# EAGLE design HOTAS_TOP_v4_v10 (EAGLE 9.7.0)
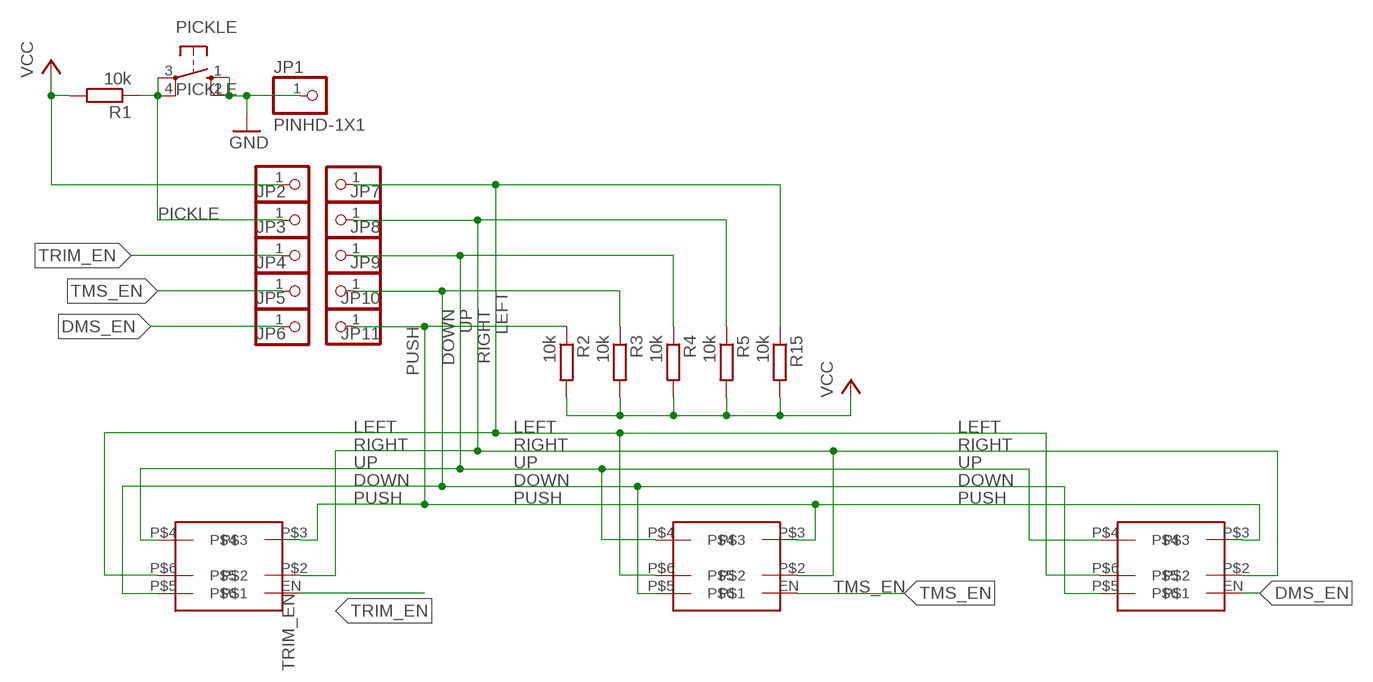
[diagram p0: schematic, sheet 1]

## Parts
JP1  PINHD-1X1  [1X01]
JP2  PINHD-1X1  [1X01]
JP3  PINHD-1X1  [1X01]
JP4  PINHD-1X1  [1X01]
JP5  PINHD-1X1  [1X01]
JP6  PINHD-1X1  [1X01]
JP7  PINHD-1X1  [1X01]
JP8  PINHD-1X1  [1X01]
JP9  PINHD-1X1  [1X01]
JP10  PINHD-1X1  [1X01]
JP11  PINHD-1X1  [1X01]
PICKLE  10-XX  [B3F-10XX]
R1  10k  R_CHIP-1206(3216-METRIC)  [RESC3216X70]
R2  10k  R_CHIP-1206(3216-METRIC)  [RESC3216X70]
R3  10k  R_CHIP-1206(3216-METRIC)  [RESC3216X70]
R4  10k  R_CHIP-1206(3216-METRIC)  [RESC3216X70]
R5  10k  R_CHIP-1206(3216-METRIC)  [RESC3216X70]
R15  10k  R_CHIP-1206(3216-METRIC)  [RESC3216X70]
U$1  FIVEWAYHATSSMD  [FIVEWAYHATSSMD]
U$2  FIVEWAYHATSSMD  [FIVEWAYHATSSMD]
U$3  FIVEWAYHATSSMD  [FIVEWAYHATSSMD]

## Nets
DMS_EN: JP6.1 U$3.EN
DOWN: JP10.1 R3.1 U$1.P$5 U$2.P$5 U$3.P$5
GND: JP1.1 PICKLE.1(S) PICKLE.2(S1)
LEFT: JP7.1 R15.1 U$1.P$6 U$2.P$6 U$3.P$6
PICKLE: JP3.1 PICKLE.3(P) PICKLE.4(P1) R1.1
PUSH: JP11.1 R2.1 U$1.P$3 U$2.P$3 U$3.P$3
RIGHT: JP8.1 R5.1 U$1.P$2 U$2.P$2 U$3.P$2
TMS_EN: JP5.1 U$2.EN
TRIM_EN: JP4.1 U$1.EN
UP: JP9.1 R4.1 U$1.P$4 U$2.P$4 U$3.P$4
VCC: JP2.1 R1.2 R2.2 R3.2 R4.2 R5.2 R15.2

## Library data of the parts
JP1-JP11 = Connector:PINHD-1X1: PIN HEADER; CATEGORY: Headers; DESCRIPTION: Header, Straight, 1 Position; MANUFACTURER: Generic; MPN: Generic; OPERATING_TEMPERATURE: Generic; PART_STATUS: Active; PITCH: 0.100" (2.54mm); ROHS_COMPLIANCE: Generic; SERIES: Generic; SUB-CATEGORY: Headers, Male Pins; TYPE: Board to Board or Cable, Unshrouded, Through Hole, Straight
PICKLE = switch-omron:10-XX: OMRON SWITCH; MPN: B3F-1000; OC_FARNELL: 176432; OC_NEWARK: 36M3542
R1-R5 R15 = Resistor:R: Resistor Fixed - Generic; CATEGORY: Resistor; SUB-CATEGORY: Fixed
U$1-U$3 = FiveWaySMD_V6:FIVEWAYHATSSMD

## Board
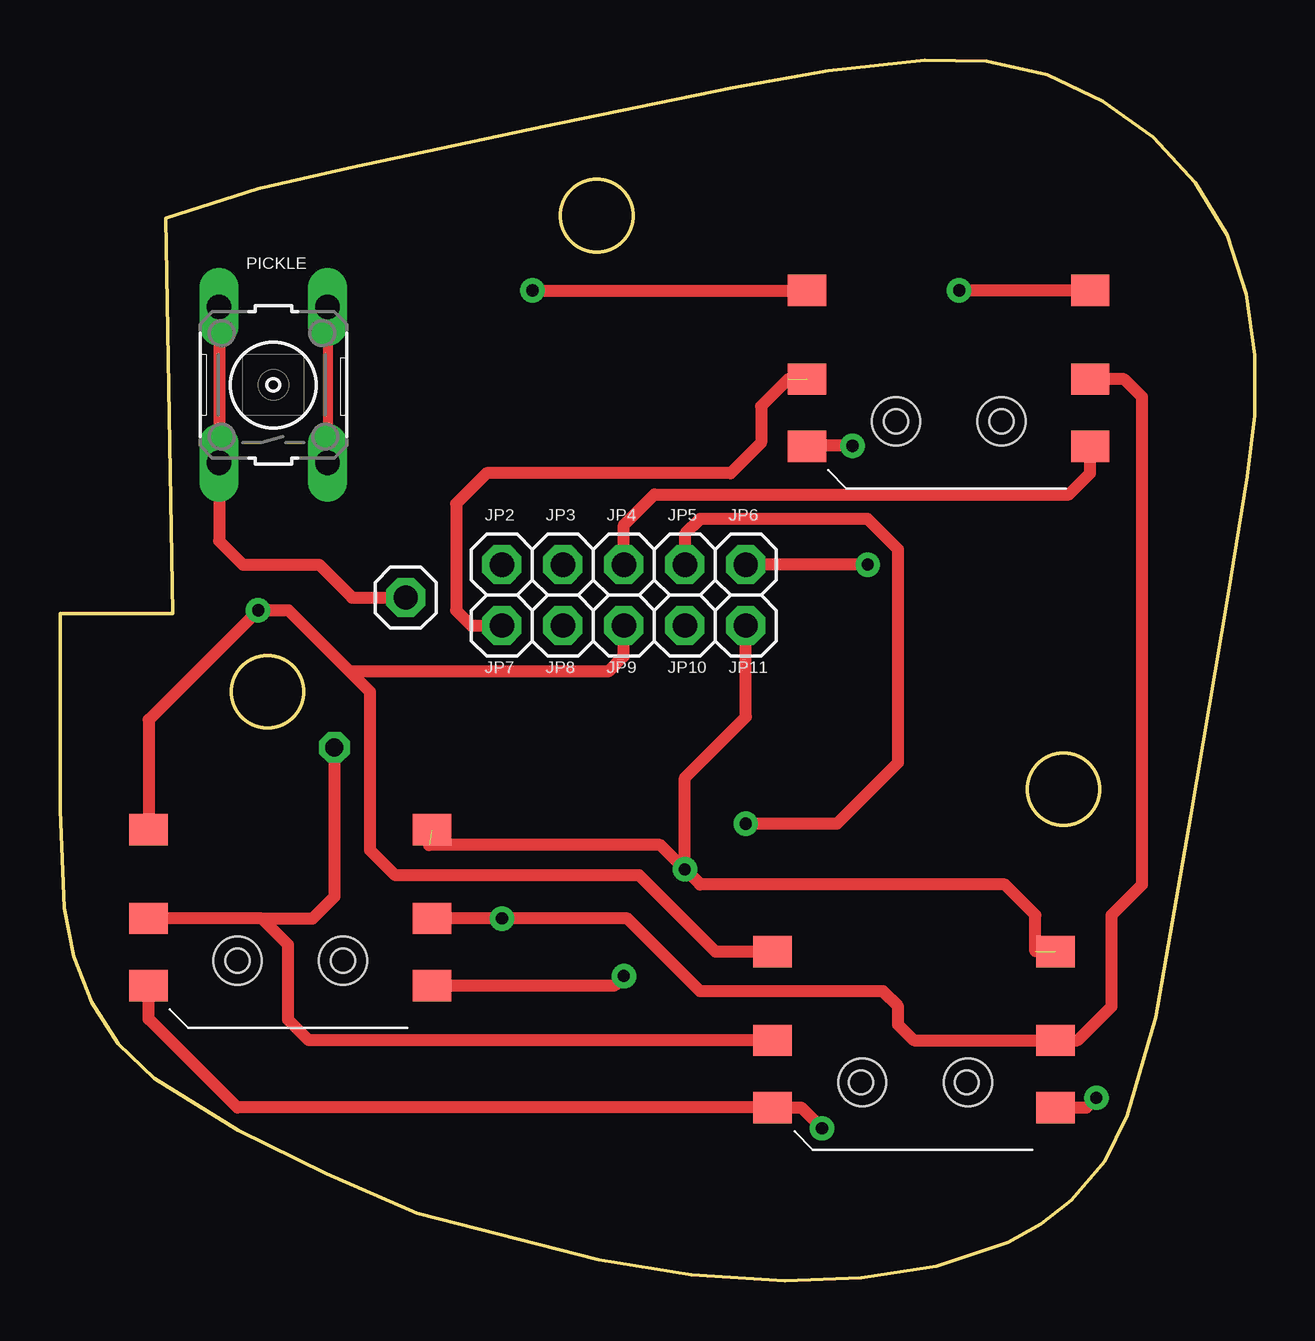
[diagram p1: board, top side]
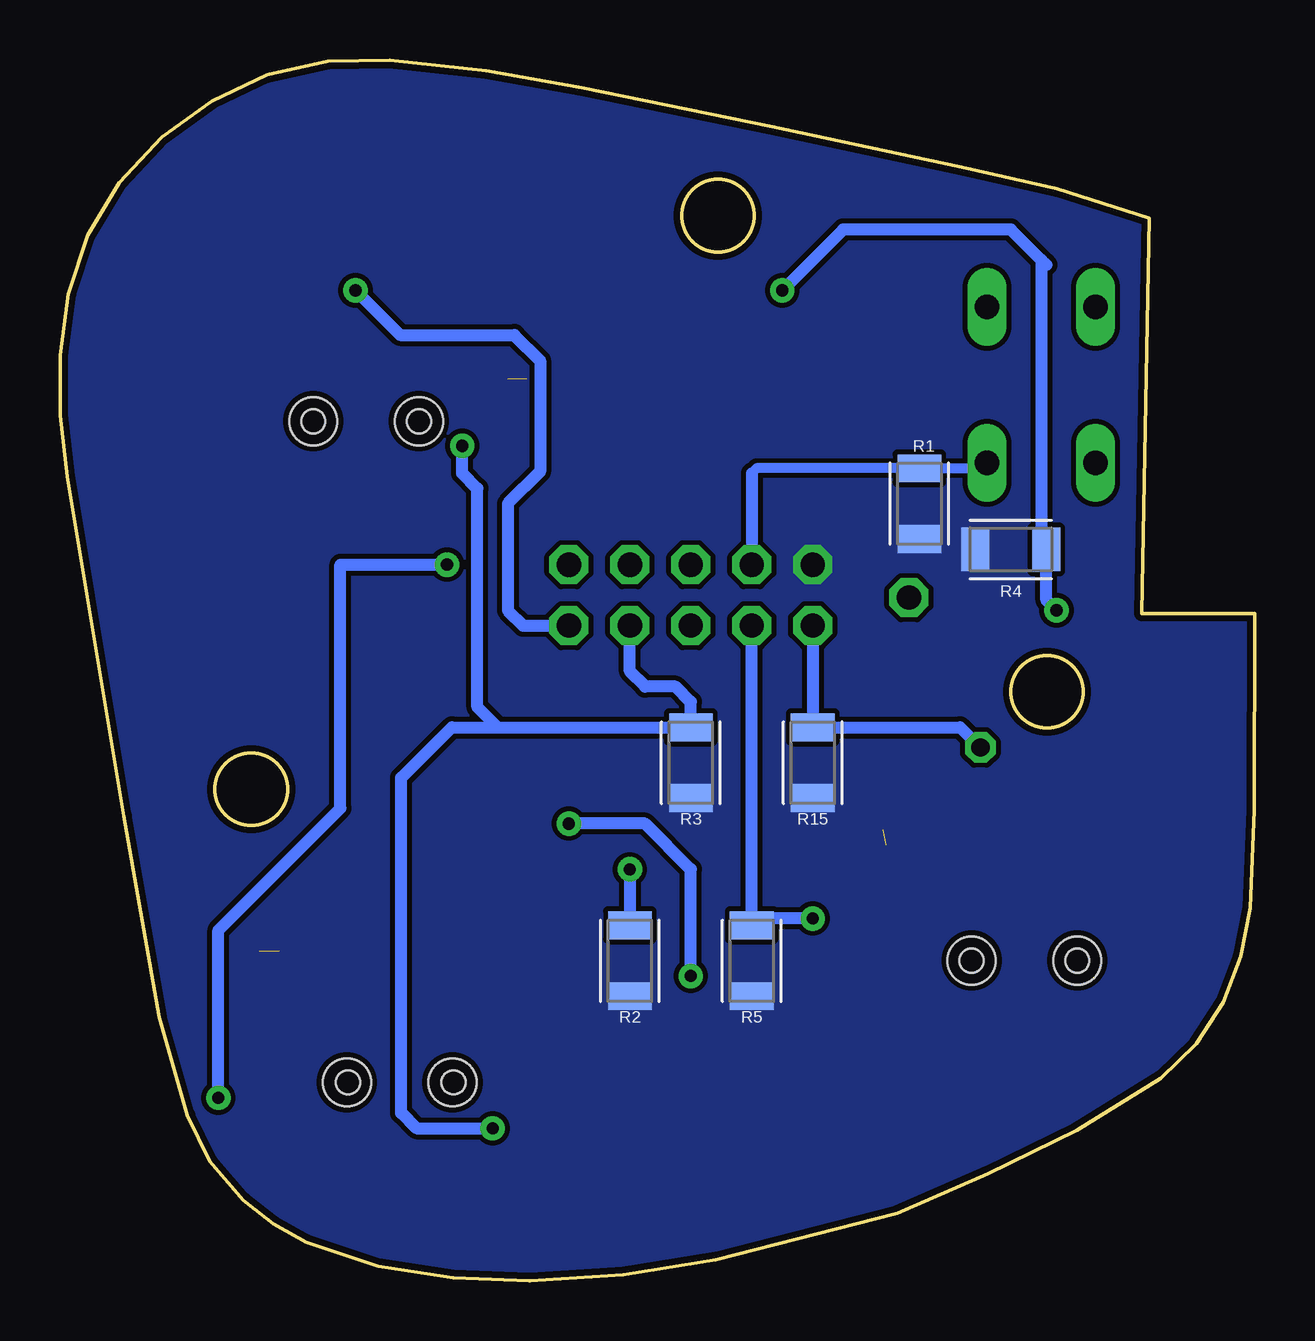
[diagram p2: board, bottom side, seen from below]

Size 49.78 x 50.88 mm. Coordinates in mm from the lower left corner, seen from the top.
Outline: 30.22,0 33.39,0.11 36.52,0.59 39.52,1.6 40.89,2.37 42.14,3.35 43.54,4.96 44.47,6.89 45.65,10.97 47.12,19.38 48.65,28.5 49.48,33.52 49.78,36.05 49.77,38.57 49.43,41.12 48.63,43.57 47.3,45.77 45.55,47.65 43.45,49.17 41.13,50.26 38.61,50.82 36.04,50.88 32.02,50.43 28.04,49.71 20.11,48.1 12.2,46.41 8.26,45.51 4.4,44.29 4.7,27.82 0,27.81 0.01,19.62 0.18,15.53 0.58,13.51 1.31,11.59 2.44,9.86 3.92,8.43 7.42,6.27 11.12,4.45 14.9,2.8 22.45,0.87 26.3,0.24 30.19,0 30.22,0
Outline: circle at 22.37,44.39 radius 1.5
Outline: circle at 41.81,20.48 radius 1.5
Outline: circle at 8.65,24.54 radius 1.5
Copper layers (1*16): Top 0.035mm / dielectric 1.5mm / Bottom 0.035mm
Design rules "SparkFun": minimum track width 8mil, minimum drill 20mil, track to track 8mil, track to pad 16mil, pad to pad 16mil, via to via 8mil, smd to smd 8mil, copper to edge 10mil, drill to drill 8mil, minimum pad ring 12mil, minimum via ring 10mil, stop-mask expansion 4mil, vias tented up to drill 25mil, thermal gap 10mil
Holes 2 mm at 34.83,35.82 39.23,35.82 7.39,13.34 11.79,13.34 33.43,8.26 37.83,8.26

### Footprints (pad centres in the part's own frame; a part is rotated, then mirrored left to right if it is on the bottom)
1X01 = drill 1.016 octagon: 1 0,0
B3F-10XX = drill 1.016 long: 1 -3.251,2.261; 2 3.251,2.261; 3 -3.251,-2.261; 4 3.251,-2.261
RESC3216X70 = smd 1.165 x 1.815: 1 -1.475,0; 2 1.475,0
FIVEWAYHATSSMD = smd 1.6 x 1.3: EN -11.05,6.5; P$2 -11.05,3.7; P$3 -11.05,0; P$4 0.75,0; P$5 0.75,6.5; P$6 0.75,3.7 | hole 1: -7.35,5.45; -2.95,5.45

### Placement (x,y rotation side)
JP1  14.41,28.47 0 top
JP2  18.41,29.84 0 top
JP3  20.95,29.84 0 top
JP4  23.5,29.84 0 top
JP5  26.04,29.84 0 top
JP6  28.57,29.84 0 top
JP7  18.41,27.3 0 top
JP8  20.95,27.3 0 top
JP9  23.5,27.3 0 top
JP10  26.04,27.3 0 top
JP11  28.57,27.3 0 top
PICKLE  8.89,37.34 90 top
R1  13.97,32.38 270 bottom
R2  26.04,13.33 270 bottom
R3  23.5,21.59 270 bottom
R4  10.16,30.48 180 bottom
R5  20.95,13.33 270 bottom
R15  18.41,21.59 270 bottom
U$1  31.88,41.27 180 top
U$2  4.45,18.79 180 top
U$3  30.43,13.71 180 top

### Tracks (layer width: path | path; a pad name or v marks a point on that pad's centre or on a via)
DMS_EN  (via drill 0.51)
  Top 0.508: v33.66,29.84 JP6.1 | U$3.EN 42.78,7.21 v43.18,7.62
  Bottom 0.508: v43.18,7.62 43.18,14.6 38.1,19.68 38.1,29.84 v33.66,29.84
DOWN  (via drill 0.51)
  Top 0.508: v33.02,34.8 31.15,34.8 U$1.P$5 | v31.75,6.35 30.88,7.21 U$3.P$5 7.39,7.21 3.69,10.91 U$2.P$5
  Bottom 0.508: 31.55,23.06 33.45,23.06 35.56,20.95 35.56,6.98 34.92,6.35 v31.75,6.35 | 31.55,23.06 R3.1 23.5,24.13 24.13,24.76 25.4,24.76 26.04,25.4 JP10.1 | 31.55,23.06 32.38,23.9 32.38,33.02 33.02,33.65 v33.02,34.8
GND
  Top 0.508: PICKLE.2 PICKLE.1 6.63,30.83 7.62,29.84 10.79,29.84 12.17,28.47 JP1.1
LEFT  (via drill 0.76)  (1 unrouted)
  Top 0.508: v11.43,22.22 11.43,16 10.52,15.09 8.41,15.09 | 30.34,37.57 29.21,36.45 29.21,34.92 27.94,33.65 17.78,33.65 16.51,32.38 16.51,27.94 17.14,27.3 JP7.1 | 8.41,15.09 9.5,14.01 9.5,10.88 10.37,10.01 U$3.P$6 | 8.41,15.09 U$2.P$6
  Bottom 0.508: v11.43,22.22 12.27,23.06 R15.1 JP7.1
PICKLE
  Top 0.406: PICKLE.4 PICKLE.3
  Bottom 0.406: PICKLE.3 11.38,33.86 R1.1 20.75,33.86 20.95,33.65
  Bottom 0.508: 20.95,33.65 JP3.1
PUSH  (via drill 0.51)  (2 unrouted)
  Top 0.508: v26.04,17.14 25.02,18.16 15.38,18.16 | 40.64,13.73 40.64,15.24 39.37,16.51 26.67,16.51 v26.04,17.14 | v26.04,17.14 26.04,20.95 28.57,23.49 JP11.1 | U$1.P$3 v37.47,41.27
  Bottom 0.508: v26.04,17.14 R2.1 | v37.47,41.27 35.61,39.42 30.84,39.42 29.78,38.35 29.78,33.72 31.11,32.38 31.11,27.94 30.48,27.3 JP11.1
RIGHT  (via drill 0.51)
  Top 0.508: U$1.P$2 44.34,37.57 45.09,36.83 45.09,16.51 43.81,15.24 43.81,11.43 42.4,10.01 U$3.P$2 35.57,10.01 34.92,10.66 34.92,11.43 34.29,12.06 26.67,12.06 23.64,15.09 v18.41,15.09 U$2.P$2
  Bottom 0.508: JP8.1 R5.1 20.67,15.09 v18.41,15.09
TMS_EN  (via drill 0.51)
  Top 0.508: v23.5,12.7 23.09,12.29 U$2.EN | v28.57,19.05 32.38,19.05 34.92,21.59 34.92,30.48 33.66,31.75 26.67,31.75 26.04,31.11 JP5.1
  Bottom 0.508: v23.5,12.7 23.5,17.14 25.4,19.05 v28.57,19.05
TRIM_EN
  Top 0.508: JP4.1 23.5,31.49 24.77,32.76 42.04,32.76 42.74,33.46 42.93,33.65 U$1.EN
UP  (via drill 0.51)
  Top 0.508: 12.06,25.4 22.86,25.4 23.5,26.03 JP9.1 | 12.06,25.4 9.53,27.94 v8.26,27.94 3.69,23.38 U$2.P$4 | 12.06,25.4 12.93,24.54 12.93,17.93 13.97,16.89 24.13,16.89 27.3,13.71 U$3.P$4 | v19.68,41.27 U$1.P$4
  Bottom 0.508: v8.26,27.94 8.69,28.37 R4.1 8.89,30.68 8.89,42.54 | 8.89,42.54 10.16,43.81 17.14,43.81 v19.68,41.27 | 8.89,42.54 8.69,42.34
VCC
  pour Bottom (no thermals): 3.24,27.9 3.22,27.87 3.19,27.86 0.08,27.86 0.08,14.62 1.97,10.21 5.76,7.05 12.09,3.88 19.7,1.34 26.68,0.07 32.38,0.07 36.81,0.71 38.71,1.34 41.23,2.6 43.12,4.49 44.38,7.01 45.65,10.81 47.55,21.6 50.09,36.2 49.46,41.25 48.19,44.41 46.3,46.93 43.14,49.46 38.72,50.72 34.3,50.72 14.62,46.91 3.25,44.39 3.25,27.92